# EAGLE design rapidshark-lipo-sensor-mk-3.0 (EAGLE 7.5.0)
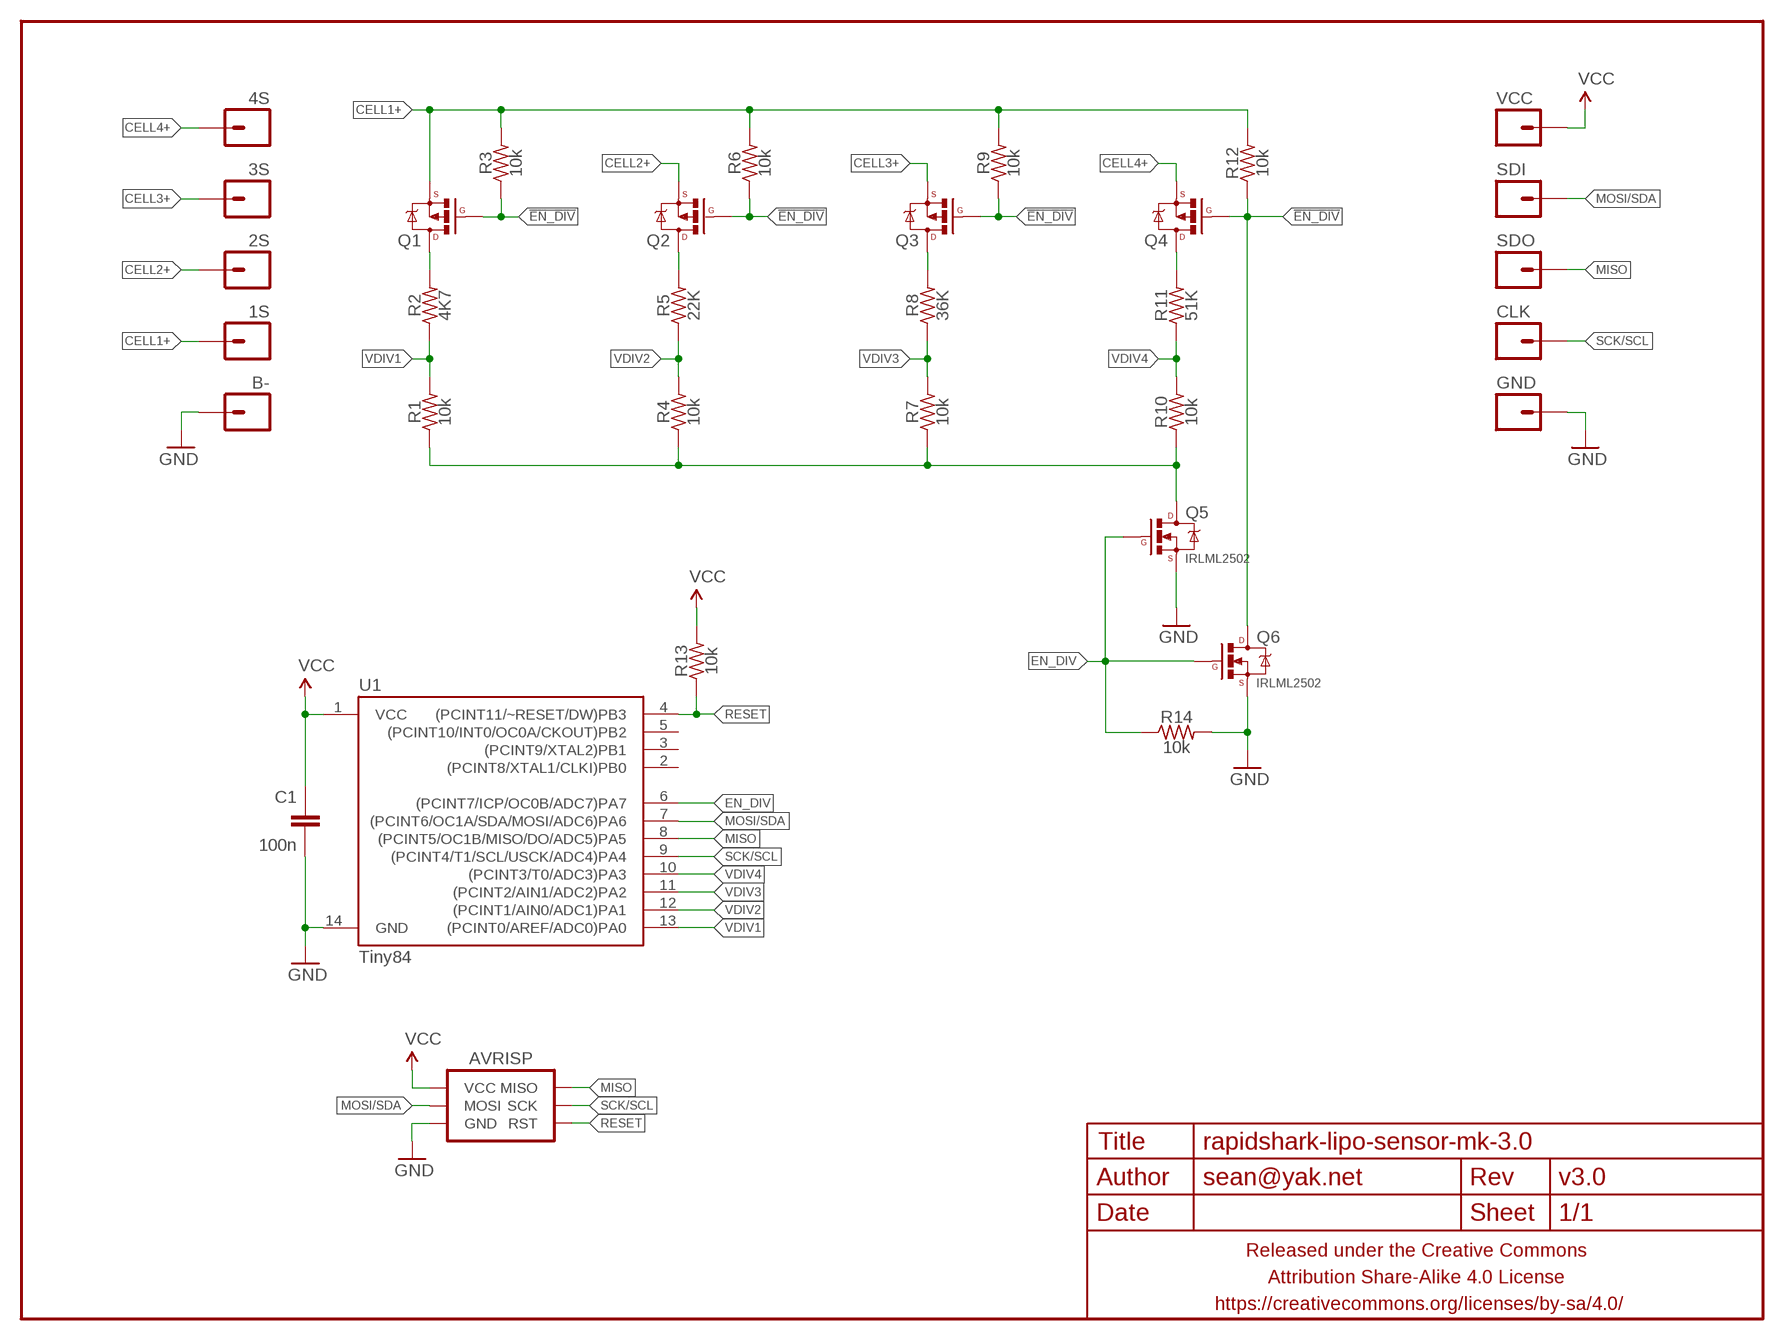
[diagram p0: schematic, sheet 1]

## Parts
1S  M01PTH-0.9MM  [1X01-0.9MM]
2S  M01PTH-0.9MM  [1X01-0.9MM]
3S  M01PTH-0.9MM  [1X01-0.9MM]
4S  M01PTH-0.9MM  [1X01-0.9MM]
AVRISP  AVR_SPI_PRG_6SMD_TEST_POINTS  [2X3_SMD_TEST_POINTS]
B-  M01PTH-0.9MM  [1X01-0.9MM]
C1  100n  CAPACITOR-CERAMICC0603-TIGHTER  [C0603-TIGHTER]
CLK  M01PTH-0.9MM  [1X01-0.9MM]
FRAME1  FRAME-LETTERNO_PACKAGE  [DUMMY]
GND  M01PTH-0.9MM  [1X01-0.9MM]
Q1  MOSFET-PCHANNELSOT-23  [SOT23]
Q2  MOSFET-PCHANNELSOT-23  [SOT23]
Q3  MOSFET-PCHANNELSOT-23  [SOT23]
Q4  MOSFET-PCHANNELSOT-23  [SOT23]
Q5  IRLML2502  MOSFET-NCHANNELIRLML2502  [SOT23]
Q6  IRLML2502  MOSFET-NCHANNELIRLML2502  [SOT23]
R1  10k  RESISTORR0603-TIGHTER  [R0603-TIGHTER]
R2  4K7  RESISTORR0603-TIGHTER  [R0603-TIGHTER]
R3  10k  RESISTORR0603-TIGHTER  [R0603-TIGHTER]
R4  10k  RESISTORR0603-TIGHTER  [R0603-TIGHTER]
R5  22K  RESISTORR0603-TIGHTER  [R0603-TIGHTER]
R6  10k  RESISTORR0603-TIGHTER  [R0603-TIGHTER]
R7  10k  RESISTORR0603-TIGHTER  [R0603-TIGHTER]
R8  36K  RESISTORR0603-TIGHTER  [R0603-TIGHTER]
R9  10k  RESISTORR0603-TIGHTER  [R0603-TIGHTER]
R10  10k  RESISTORR0603-TIGHTER  [R0603-TIGHTER]
R11  51K  RESISTORR0603-TIGHTER  [R0603-TIGHTER]
R12  10k  RESISTORR0603-TIGHTER  [R0603-TIGHTER]
R13  10k  RESISTORR0603-TIGHTER  [R0603-TIGHTER]
R14  10k  RESISTORR0603-TIGHTER  [R0603-TIGHTER]
SDI  M01PTH-0.9MM  [1X01-0.9MM]
SDO  M01PTH-0.9MM  [1X01-0.9MM]
U1  Tiny84  ATTINY84  [SO14]
VCC  M01PTH-0.9MM  [1X01-0.9MM]

## Nets
!EN_DIV: Q1.1(G) Q2.1(G) Q3.1(G) Q4.1(G) Q6.3(D) R3.1 R6.1 R9.1 R12.1
CELL1+: 1S.1 Q1.2(S) R3.2 R6.2 R9.2 R12.2
CELL2+: 2S.1 Q2.2(S)
CELL3+: 3S.1 Q3.2(S)
CELL4+: 4S.1 Q4.2(S)
EN_DIV: Q5.1(G) Q6.1(G) R14.1 U1.6((PCINT7/ICP/OC0B/ADC7)PA7)
GND: AVRISP.6(GND) B-.1 C1.2 GND.1 Q5.2(S) Q6.2(S) R14.2 U1.14(GND)
MISO: AVRISP.1(MISO) SDO.1 U1.8((PCINT5/OC1B/MISO/DO/ADC5)PA5)
MOSI/SDA: AVRISP.4(MOSI) SDI.1 U1.7((PCINT6/OC1A/SDA/MOSI/ADC6)PA6)
N$1: Q5.3(D) R1.1 R4.1 R7.1 R10.1
N$2: Q2.3(D) R5.2
N$3: Q3.3(D) R8.2
N$4: Q4.3(D) R11.2
N$6: Q1.3(D) R2.2
RESET: AVRISP.5(RST) R13.1 U1.4((PCINT11/~RESET/DW)PB3)
SCK/SCL: AVRISP.3(SCK) CLK.1 U1.9((PCINT4/T1/SCL/USCK/ADC4)PA4)
VCC: AVRISP.2(VCC) C1.1 R13.2 U1.1(VCC) VCC.1
VDIV1: R1.2 R2.1 U1.13((PCINT0/AREF/ADC0)PA0)
VDIV2: R4.2 R5.1 U1.12((PCINT1/AIN0/ADC1)PA1)
VDIV3: R7.2 R8.1 U1.11((PCINT2/AIN1/ADC2)PA2)
VDIV4: R10.2 R11.1 U1.10((PCINT3/T0/ADC3)PA3)
Unconnected: U1.2((PCINT8/XTAL1/CLKI)PB0) U1.3((PCINT9/XTAL2)PB1) U1.5((PCINT10/INT0/OC0A/CKOUT)PB2)

## Library data of the parts
1S 2S 3S 4S B- CLK GND SDI SDO VCC = a_parts:M01: Header 1 Standard 1-pin 0.1" header. Use with straight break away headers (SKU : PRT-00116), right angle break away headers (PRT-00553), swiss pins (PRT-00743), machine pins (PRT-00117), and female headers (PRT-00115).
AVRISP = A_butts:AVR_SPI_PRG_6: AVR ISP 6 Pin This is the reduced ISP connector for AVR programming. Common on Arduino. This footprint will take up less PCB space and can be used with a 10-pin to 6-pin adapter such as SKU: BOB-08508 **Special note about "TEST_POINT" package. The stop mask is on the top side, so if you want your programming test points to be on the bottom of your board, make sure to place this package on the bottom side of the board. This also ensure that the orientation to program from the bottom side will be correct.
C1 = a_parts:CAPACITOR-CERAMIC: CAPACITOR, European symbol
FRAME1 = A_butts:FRAME-LETTER: Schematic Frame Standard 8.5x11 US Letter frame; DESIGNER: sean@yak.net; VERSION: v3.0
Q1-Q4 = a_parts:MOSFET-PCHANNEL: Generic PMOSFET IRLML2244 - TRANS-11153 (SOT-23 -20V -4.3A) (1.Gate 2.Source 3.Drain) FQP27P06 - COM-10349 <http://www.sparkfun.com/products/10349> (TO-220 -60V -27A) (1.Gate 2.Source 3.Drain)
Q5 Q6 = a_parts:MOSFET-NCHANNEL: Common NMOSFET Parts MFG P/N Store ID Prod ID FDD8780 TRANS-09984 SI7820DN TRANS-11055 FDS6630A IC-08089 2N7002PW TRANS-11151 FQP30N06L COM-10213 TRANS-10060 BSS123LT1G TRANS-08345 BSS138 TRANS-00830 BS170 2N7000
R1-R14 = a_parts:RESISTOR: RESISTOR, American symbol
U1 = A_butts:ATTINY84: Atmel 14-pin 2/4/8kB flash uC

## Board
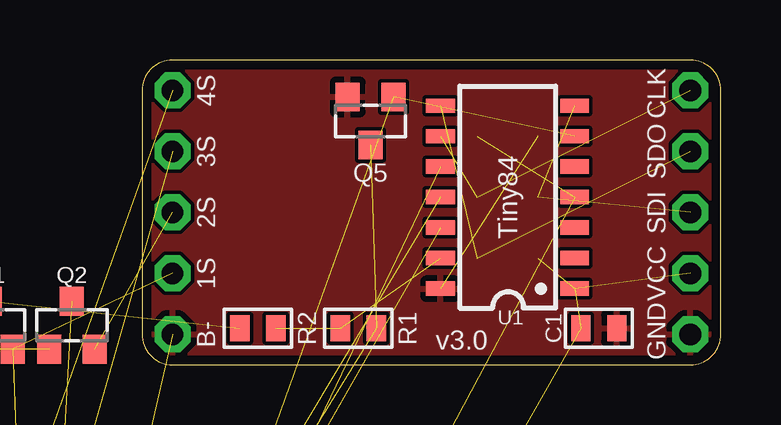
[diagram p1: board, top side]
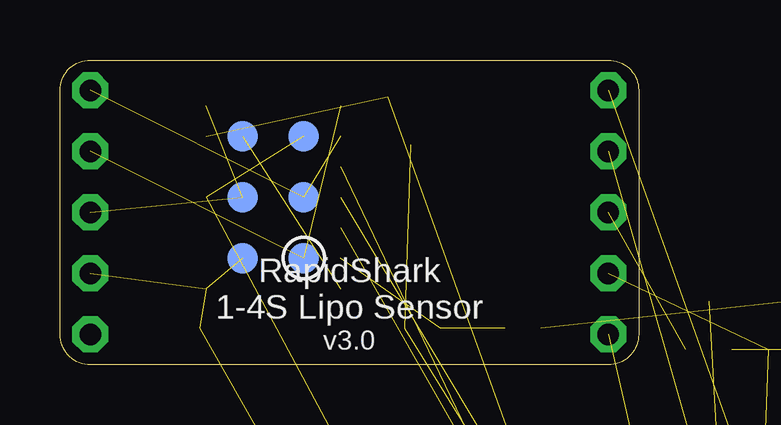
[diagram p2: board, bottom side, seen from below]

Size 24.13 x 12.7 mm. Coordinates in mm from the lower left corner, seen from the top.
Outline: 24.13,1.27 24.13,11.43 arc90 22.86,12.7 1.27,12.7 arc90 0,11.43 0,1.27 arc90 1.27,0 22.86,0 arc90 24.13,1.27
Copper layers (1*16): Top 0.0356mm / dielectric 1.5011mm / Bottom 0.0356mm
Design rules "LaenPCBOrder_2": minimum track width 6mil, minimum drill 13mil, track to track 6mil, track to pad 6mil, pad to pad 6mil, via to via 6mil, smd to smd 6mil, copper to edge 15mil, drill to drill 6mil, minimum pad ring 7mil, minimum via ring 7mil, stop-mask expansion 3mil, vias tented up to drill 20mil, thermal gap 10mil

### Footprints (pad centres in the part's own frame; a part is rotated, then mirrored left to right if it is on the bottom)
1X01-0.9MM = drill 0.9 pad 1.5 octagon: 1 0,0
2X3_SMD_TEST_POINTS = smd 1.27 x 1.27: 1 -2.54,-1.27; 2 -2.54,1.27; 3 0,-1.27; 4 0,1.27; 5 2.54,-1.27; 6 2.54,1.27
C0603-TIGHTER = smd 0.8 x 1.1: 1 -0.75,0; 2 0.75,0
SOT23 = smd 1 x 1.2: 1 -0.95,-1; 2 0.95,-1; 3 0,1
R0603-TIGHTER = smd 0.8 x 1.1: 1 -0.75,0; 2 0.75,0
SO14 = smd 0.6 x 1.2: 1 -3.81,-2.8; 2 -2.54,-2.8; 3 -1.27,-2.8; 4 0,-2.8; 5 1.27,-2.8; 6 2.54,-2.8; 7 3.81,-2.8; 8 3.81,2.8; 9 2.54,2.8; 10 1.27,2.8; 11 0,2.8; 12 -1.27,2.8; 13 -2.54,2.8; 14 -3.81,2.8

### Placement (x,y rotation side)
1S  1.27,3.81 270 top
2S  1.27,6.35 270 top
3S  1.27,8.89 270 top
4S  1.27,11.43 270 top
AVRISP  15.24,6.99 90 bottom
B-  1.27,1.27 270 top
C1  19.05,1.52 0 top
CLK  22.86,11.43 90 top
FRAME1  0,0 0 top
GND  22.86,1.27 90 top
Q1  -6.35,1.65 0 top  (outside the outline)
Q2  -2.92,1.65 0 top
Q3  -9.78,-25.4 0 top  (outside the outline)
Q4  -13.21,-25.4 0 top  (outside the outline)
Q5  9.53,10.16 180 top
Q6  -16.64,-52.45 0 top  (outside the outline)
R1  9.02,1.52 180 top
R2  4.83,1.52 180 top
R3  -5.33,-21.21 0 top  (outside the outline)
R4  -5.33,-24.13 0 top  (outside the outline)
R5  -5.33,-27.05 0 top  (outside the outline)
R6  -12.19,-29.97 0 top  (outside the outline)
R7  -12.19,-32.89 0 top  (outside the outline)
R8  -12.19,-35.81 0 top  (outside the outline)
R9  -12.19,-38.73 0 top  (outside the outline)
R10  -12.19,-41.66 0 top  (outside the outline)
R11  -12.19,-44.7 0 top  (outside the outline)
R12  -12.19,-47.75 0 top  (outside the outline)
R13  -12.19,-50.8 0 top  (outside the outline)
R14  -12.19,-53.85 0 top  (outside the outline)
SDI  22.86,6.35 90 top
SDO  22.86,8.89 90 top
U1  15.24,6.99 90 top
VCC  22.86,3.81 90 top

### Tracks (layer width: path | path; a pad name or v marks a point on that pad's centre or on a via)
!EN_DIV  (8 unrouted)
CELL1+  (5 unrouted)
CELL2+  (1 unrouted)
CELL3+  (1 unrouted)
CELL4+  (1 unrouted)
EN_DIV  (3 unrouted)
GND  (3 unrouted)
  pour Top: 0,1.27 0,11.43 arc-90 1.27,12.7 22.86,12.7 arc-90 24.13,11.43 24.13,1.27 arc-90 22.86,0 1.27,0 arc-90
MISO  (2 unrouted)
MOSI/SDA  (2 unrouted)
N$1  (4 unrouted)
N$2  (1 unrouted)
N$3  (1 unrouted)
N$4  (1 unrouted)
N$6  (1 unrouted)
RESET  (2 unrouted)
SCK/SCL  (2 unrouted)
VCC  (4 unrouted)
VDIV1  (2 unrouted)
VDIV2  (2 unrouted)
VDIV3  (2 unrouted)
VDIV4  (2 unrouted)

### Text on the board
bPlace: RapidShark / 1-4S Lipo Sensor